# Altium schematic sheet Steering_Converter_1R1.SchDoc: Steering Controller
size A3; Author: Harris Tomy & Neil Patil; Organization: The University of Auckland; Address1: Room XXX, Building 405; Address2: 20 Symonds Street; Address3: Auckland; Address4: New Zealand; Revision: 1R1; SheetNumber: 1; SheetTotal: 1
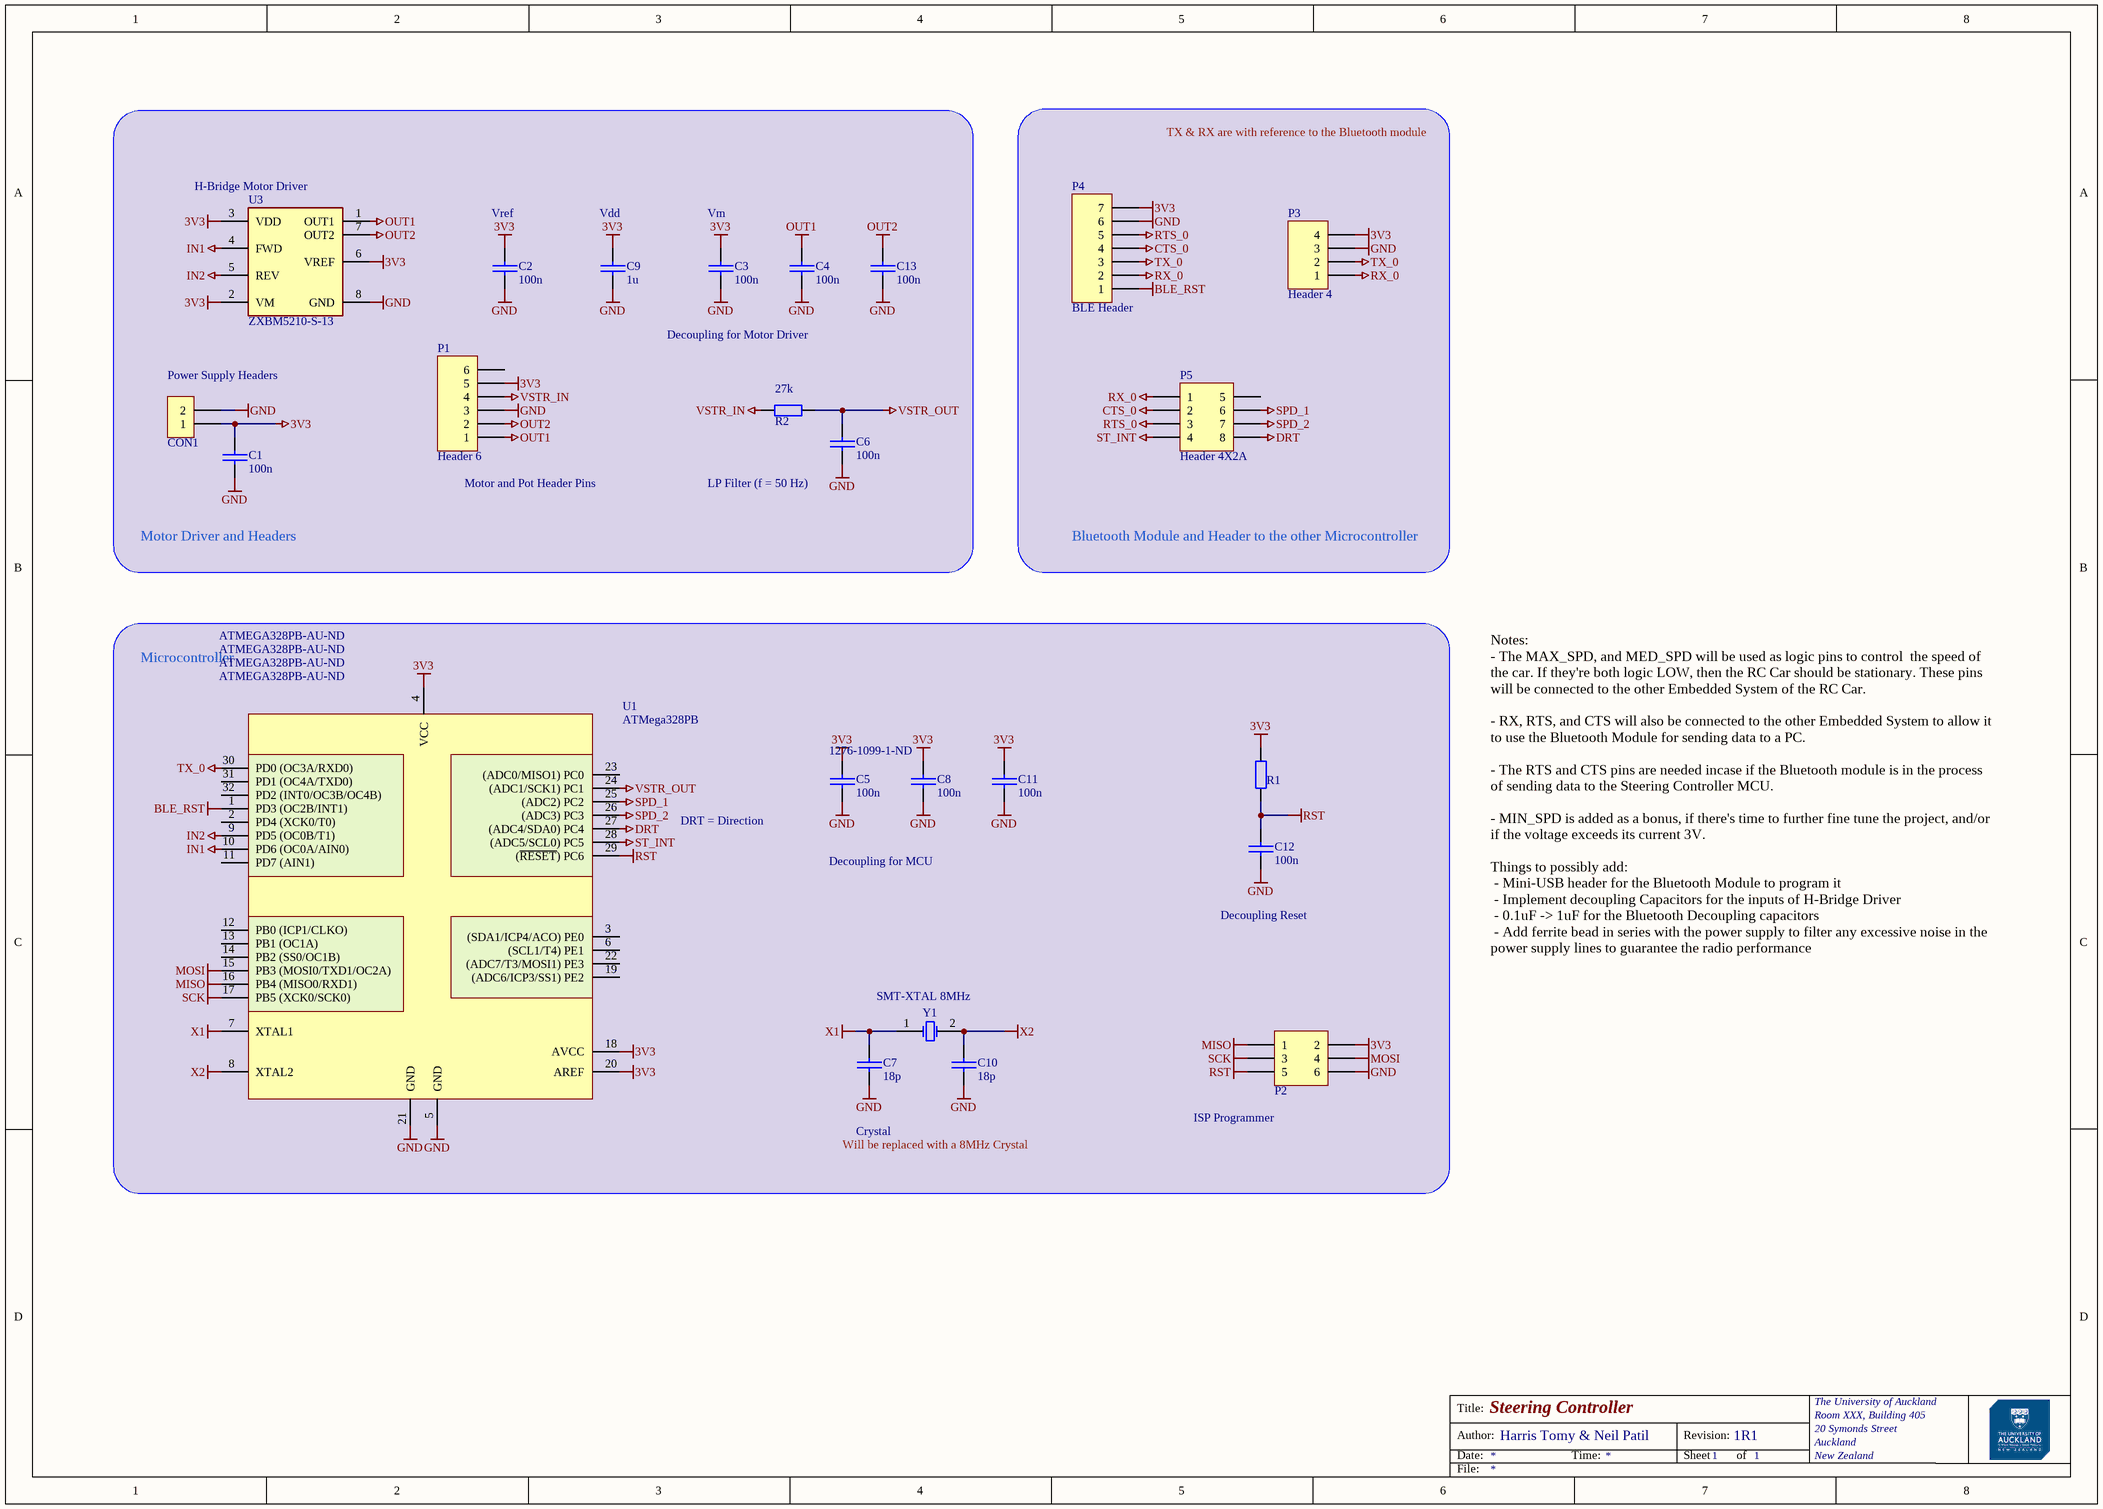
[diagram p0: Steering_Converter_1R1.SchDoc]

## Parts
C1  100n  [C0805]
C2  100n  [C0805]
C3  100n  [C0805]
C4  100n  [C0805]
C5  100n  Supplier Part Number 1: 1276-1099-1-ND  [C0805]
C6  100n  [C0805]
C7  18p  [C0805]
C8  100n  [C0805]
C9  1u  [C0805]
C10  18p  [C0805]
C11  100n  [C0805]
C12  100n  [C0805]
C13  100n  [C0805]
CON1  Header 2X1  [HDR2X1_2P54]  (value not drawn)
P1  Header 6  [HDR1X6]
P2  HDR3X2  [HDR2X3_2P54]  (value not drawn)
P3  Header 4  [HDR1X4]
P4  BLE Header  [HDR1X7]
P5  Header 4X2A  [HDR2X4_CEN]
R1  Resistor 0805  [R0805]  (value not drawn)
R2  Resistor 0805  [R0805]  (value not drawn)
U1  ATMega328PB  Supplier Part Number 1: ATMEGA328PB-AU-ND  [TQFP32]
U3  Part Number: ZXBM5210-S-13  [Diodes_ZXBM5210-S-13_0]  (hidden comment: IC_Diodes_ZXBM5210-S-13_eec)
Y1  SMT-XTAL 8MHz  [HC49-US]

## Blocks framed on the sheet
Motor Driver and Headers: C1-C4 C6 C9 C13 CON1 P1 R2 U3
Bluetooth Module and Header to the other Microcontroller: P3-P5
Microcontroller: C5 C7 C8 C10-C12 P2 R1 U1 Y1

## Nets
3V3: C1.2 C2.2 C3.2 C5.2 C8.2 C9.2 C11.2 CON1.1 P1.5 P2.2 P3.4 P4.7 R1.2 U1.4(VCC) U1.18(AVCC) U1.20(AREF) U3.2(VM) U3.3(VDD) U3.6(VREF)
BLE_RST: P4.1 U1.1(PD3_(OC2B/INT1))
CTS_0: P4.4 P5.2
DRT: P5.8 U1.27((ADC4/SDA0)_PC4)
GND: C1.1 C2.1 C3.1 C4.1 C5.1 C6.1 C7.1 C8.1 C9.1 C10.1 C11.1 C12.1 C13.1 CON1.2 P1.3 P2.6 P3.3 P4.6 U1.5(GND) U1.21(GND) U3.8(GND)
IN1: U1.10(PD6_(OC0A/AIN0)) U3.4(FWD)
IN2: U1.9(PD5_(OC0B/T1)) U3.5(REV)
MISO: P2.1 U1.16(PB4_(MISO0/RXD1))
MOSI: P2.4 U1.15(PB3_(MOSI0/TXD1/OC2A))
OUT1: C4.2 P1.1 U3.1(OUT1)
OUT2: C13.2 P1.2 U3.7(OUT2)
RST: C12.2 P2.5 R1.1 U1.29((~{RESET})_PC6)
RTS_0: P4.5 P5.3
RX_0: P3.1 P4.2 P5.1
SCK: P2.3 U1.17(PB5_(XCK0/SCK0))
SPD_1: P5.6 U1.25((ADC2)_PC2)
SPD_2: P5.7 U1.26((ADC3)_PC3)
ST_INT: P5.4 U1.28((ADC5/SCL0)_PC5)
TX_0: P3.2 P4.3 U1.30(PD0_(OC3A/RXD0))
VSTR_IN: P1.4 R2.1
VSTR_OUT: C6.2 R2.2 U1.24((ADC1/SCK1)_PC1)
X1: C7.2 U1.7(XTAL1) Y1.1(OSC1)
X2: C10.2 U1.8(XTAL2) Y1.2(OSC2)

Not connected (* = marked no-connect by the designer): P1 6; P5 5; U1 2(PD4_(XCK0/T0)) 3((SDA1/ICP4/ACO)_PE0) 6((SCL1/T4)_PE1) 11(PD7_(AIN1)) 12(PB0_(ICP1/CLKO)) 13(PB1_(OC1A)) 14(PB2_(SS0/OC1B)) 19((ADC6/ICP3/SS1)_PE2) 22((ADC7/T3/MOSI1)_PE3) 23((ADC0/MISO1)_PC0) 31(PD1_(OC4A/TXD0)) 32(PD2_(INT0/OC3B/OC4B))

## Notes on the sheet
- TX & RX are with reference to the Bluetooth module
- (near U3) H-Bridge Motor Driver
- (near C2) Vref
- (near C9) Vdd
- (near C3) Vm
- (near CON1) Power Supply Headers
- Decoupling for Motor Driver
- (near R2) 27k
- (near P1) Motor and Pot Header Pins
- (near C6) LP Filter (f = 50 Hz)
- DRT = Direction
- Decoupling for MCU
- Decoupling Reset
- Notes:
  - The MAX_SPD, and MED_SPD will be used as logic pins to control  the speed of the car. If they're both logic LOW, then the RC Car should be stationary. These pins will be connected to the other Embedded System of the RC Car.
  - RX, RTS, and CTS will also be connected to the other Embedded System to allow it to use the Bluetooth Module for sending data to a PC.
  - The RTS and CTS pins are needed incase if the Bluetooth module is in the process of sending data to the Steering Controller MCU.
  - MIN_SPD is added as a bonus, if there's time to further fine tune the project, and/or if the voltage exceeds its current 3V.
  Things to possibly add:
  - Mini-USB header for the Bluetooth Module to program it
  - Implement decoupling Capacitors for the inputs of H-Bridge Driver
  - 0.1uF -> 1uF for the Bluetooth Decoupling capacitors
  - Add ferrite bead in series with the power supply to filter any excessive noise in the power supply lines to guarantee the radio performance
- (near P2) ISP Programmer
- Will be replaced with a 8MHz Crystal
- Crystal
- Title:
- Author:
- Date:
- Time:
- Revision:
- Sheet
- of
- File:

## Library data of the parts
C1-C13 = CCAP0805: Type: Surface Mount; MPN: ?; Part Description: ?; Value: ?
  C5: Supplier 1: Digi-Key
CON1 = HDR2X1
P1 = Header 6: Header, 6-Pin; LatestRevisionDate: 17-Jul-2002; LatestRevisionNote: Re-released for DXP Platform.; Publisher: Altium Limited
P2 = HDR3X2: Header, 3-Pin, Dual row
P3 = Header 4: Header, 4-Pin; LatestRevisionDate: 17-Jul-2002; LatestRevisionNote: Re-released for DXP Platform.; Publisher: Altium Limited
P4 = Header 7: Header, 7-Pin; LatestRevisionDate: 17-Jul-2002; LatestRevisionNote: Re-released for DXP Platform.; Publisher: Altium Limited
P5 = Header 4X2A: Header, 4-Pin, Dual row; LatestRevisionDate: 17-Jul-2002; LatestRevisionNote: Re-released for DXP Platform.; Publisher: Altium Limited
R1 R2 = RES0805: MPN: ?; Value: ?; Part Description: ?; Type: Surface Mount
U1 = ATMega328PB: IC MCU 8BIT 32KB FLASH 32TQFP; Supplier 1: Digi-Key; Supplier 2: Digi-Key; Supplier Part Number 2: ATMEGA328PB-AU-ND; Supplier 3: Digi-Key; Supplier Part Number 3: ATMEGA328PB-AU-ND; Supplier 4: Digi-Key; Supplier Part Number 4: ATMEGA328PB-AU-ND
U3 = IC_Diodes_ZXBM5210-S-13_eec: IC MOTOR DRIVER PWM 8SOIC; Manufacturer: Diodes; Voltage: 18V; helpURL: https://upverter.com/upn/revision/7a867377f73a3c32/; ComponentLink2Description: Datasheet; Temperature: -40°C to +85°C; Package: SO-8; Supplier 2: Mouser; Price: 0.759009212461; Supplier 1: Digi-Key; ComponentLink1URL: https://upverter.com/upn/revision/7a867377f73a3c32/; Supplier Part Number 2: 621-ZXBM5210-S-13; Supplier Part Number 1: ZXBM5210-S-13DICT-ND; ComponentLink1Description: Upverter; ComponentLink2URL: https://www.diodes.com/assets/Datasheets/ZXBM5210.pdf; RoHS: TRUE; Mouser Part Number: 621-ZXBM5210-S-13; Temperature Range High: +85°C; Digikey Description: IC MOTOR DRIVER PWM 8SOIC; Digikey Part Number: ZXBM5210-S-13DICT-ND; Lead Free: yes; Temperature Range Low: -40°C
Y1 = TXC9C-16_XTAL_SMT: 9C-16.000MAAJ-T crystal 16.0000MHZ 18PF SMD; Manufacturer: TXC CORPORATION; Frequency Stability: ±30ppm; Operating Mode: Fundamental; Supplier 1: Digi-Key; Manufacturer Part Number: 9C-16.000MAAJ-T; RoHS: RoHS Compliant; Category: Crystals, Oscillators, Resonators; Stock 1: 11514; Pricing 1: 1=0.75, 10=0.628, 50=0.5656, 100=0.5026, 500=0.47744 (NZD); Packaging: Cut Tape (CT); Part Status: Active; Type: MHz Crystal; Frequency Tolerance: ±30ppm; Load Capacitance: 18pF; Operating Temperature: -20°C ~ 70°C; Ratings: -; Mounting Type: Surface Mount; Package / Case: HC-49/US; Size / Dimension: 0.449" L x 0.189" W (11.40mm x 4.80mm); Height - Seated (Max): 0.161" (4.10mm); ComponentLink1URL: http://www.txccorp.com/download/products/quartz_crystals/2015TXC_9C_32.pdf; ComponentLink1Description: http://www.txccorp.com/download/products/quartz_crystals/2015TXC_9C_32.pdf; Supplier Part Number 1: 887-1059-1-ND